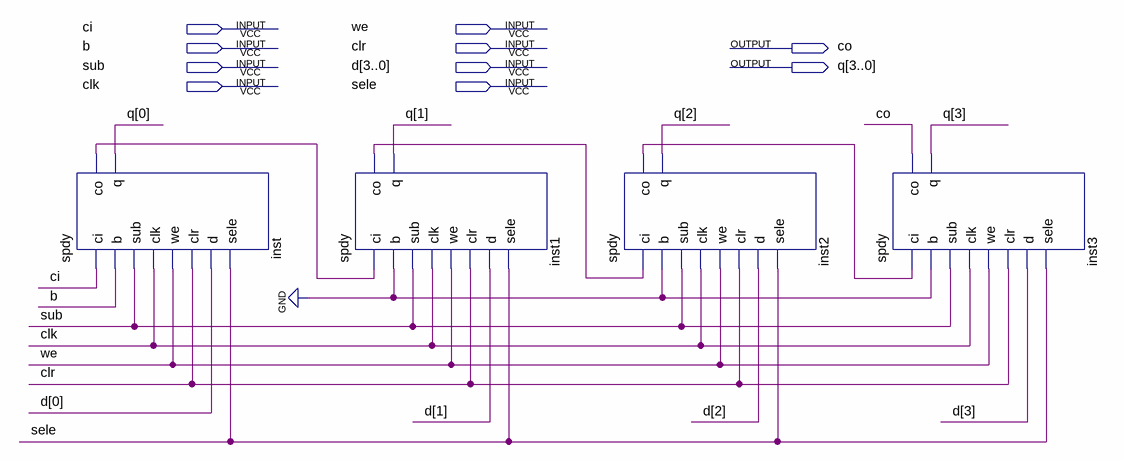
[diagram p0: schematic sheet]
// Quartus schematic spdy4.bdf as structural Verilog: 4 symbols, 10 pins
module spdy4 (
  input  ci,
  input  we,
  input  b,
  input  clr,
  input  sub,
  input  [3:0] d,
  input  clk,
  input  sele,
  output co,
  output [3:0] q
);

  wire inst1_co, inst2_co, inst_co;

  spdy inst (.ci(ci), .b(b), .sub(sub), .clk(clk), .we(we), .clr(clr), .d(d[0]), .sele(sele), .co(inst_co), .q(q[0]));
  spdy inst1 (
    .ci(inst_co), .b(1'b0), .sub(sub), .clk(clk), .we(we), .clr(clr), .d(d[1]), .sele(sele), .co(inst1_co),
    .q(q[1]));
  spdy inst2 (
    .ci(inst1_co), .b(1'b0), .sub(sub), .clk(clk), .we(we), .clr(clr), .d(d[2]), .sele(sele), .co(inst2_co),
    .q(q[2]));
  spdy inst3 (
    .ci(inst2_co), .b(1'b0), .sub(sub), .clk(clk), .we(we), .clr(clr), .d(d[3]), .sele(sele), .co(co),
    .q(q[3]));
endmodule
